# EAGLE design SMD Practice Board rev2 (EAGLE 9.1.3)
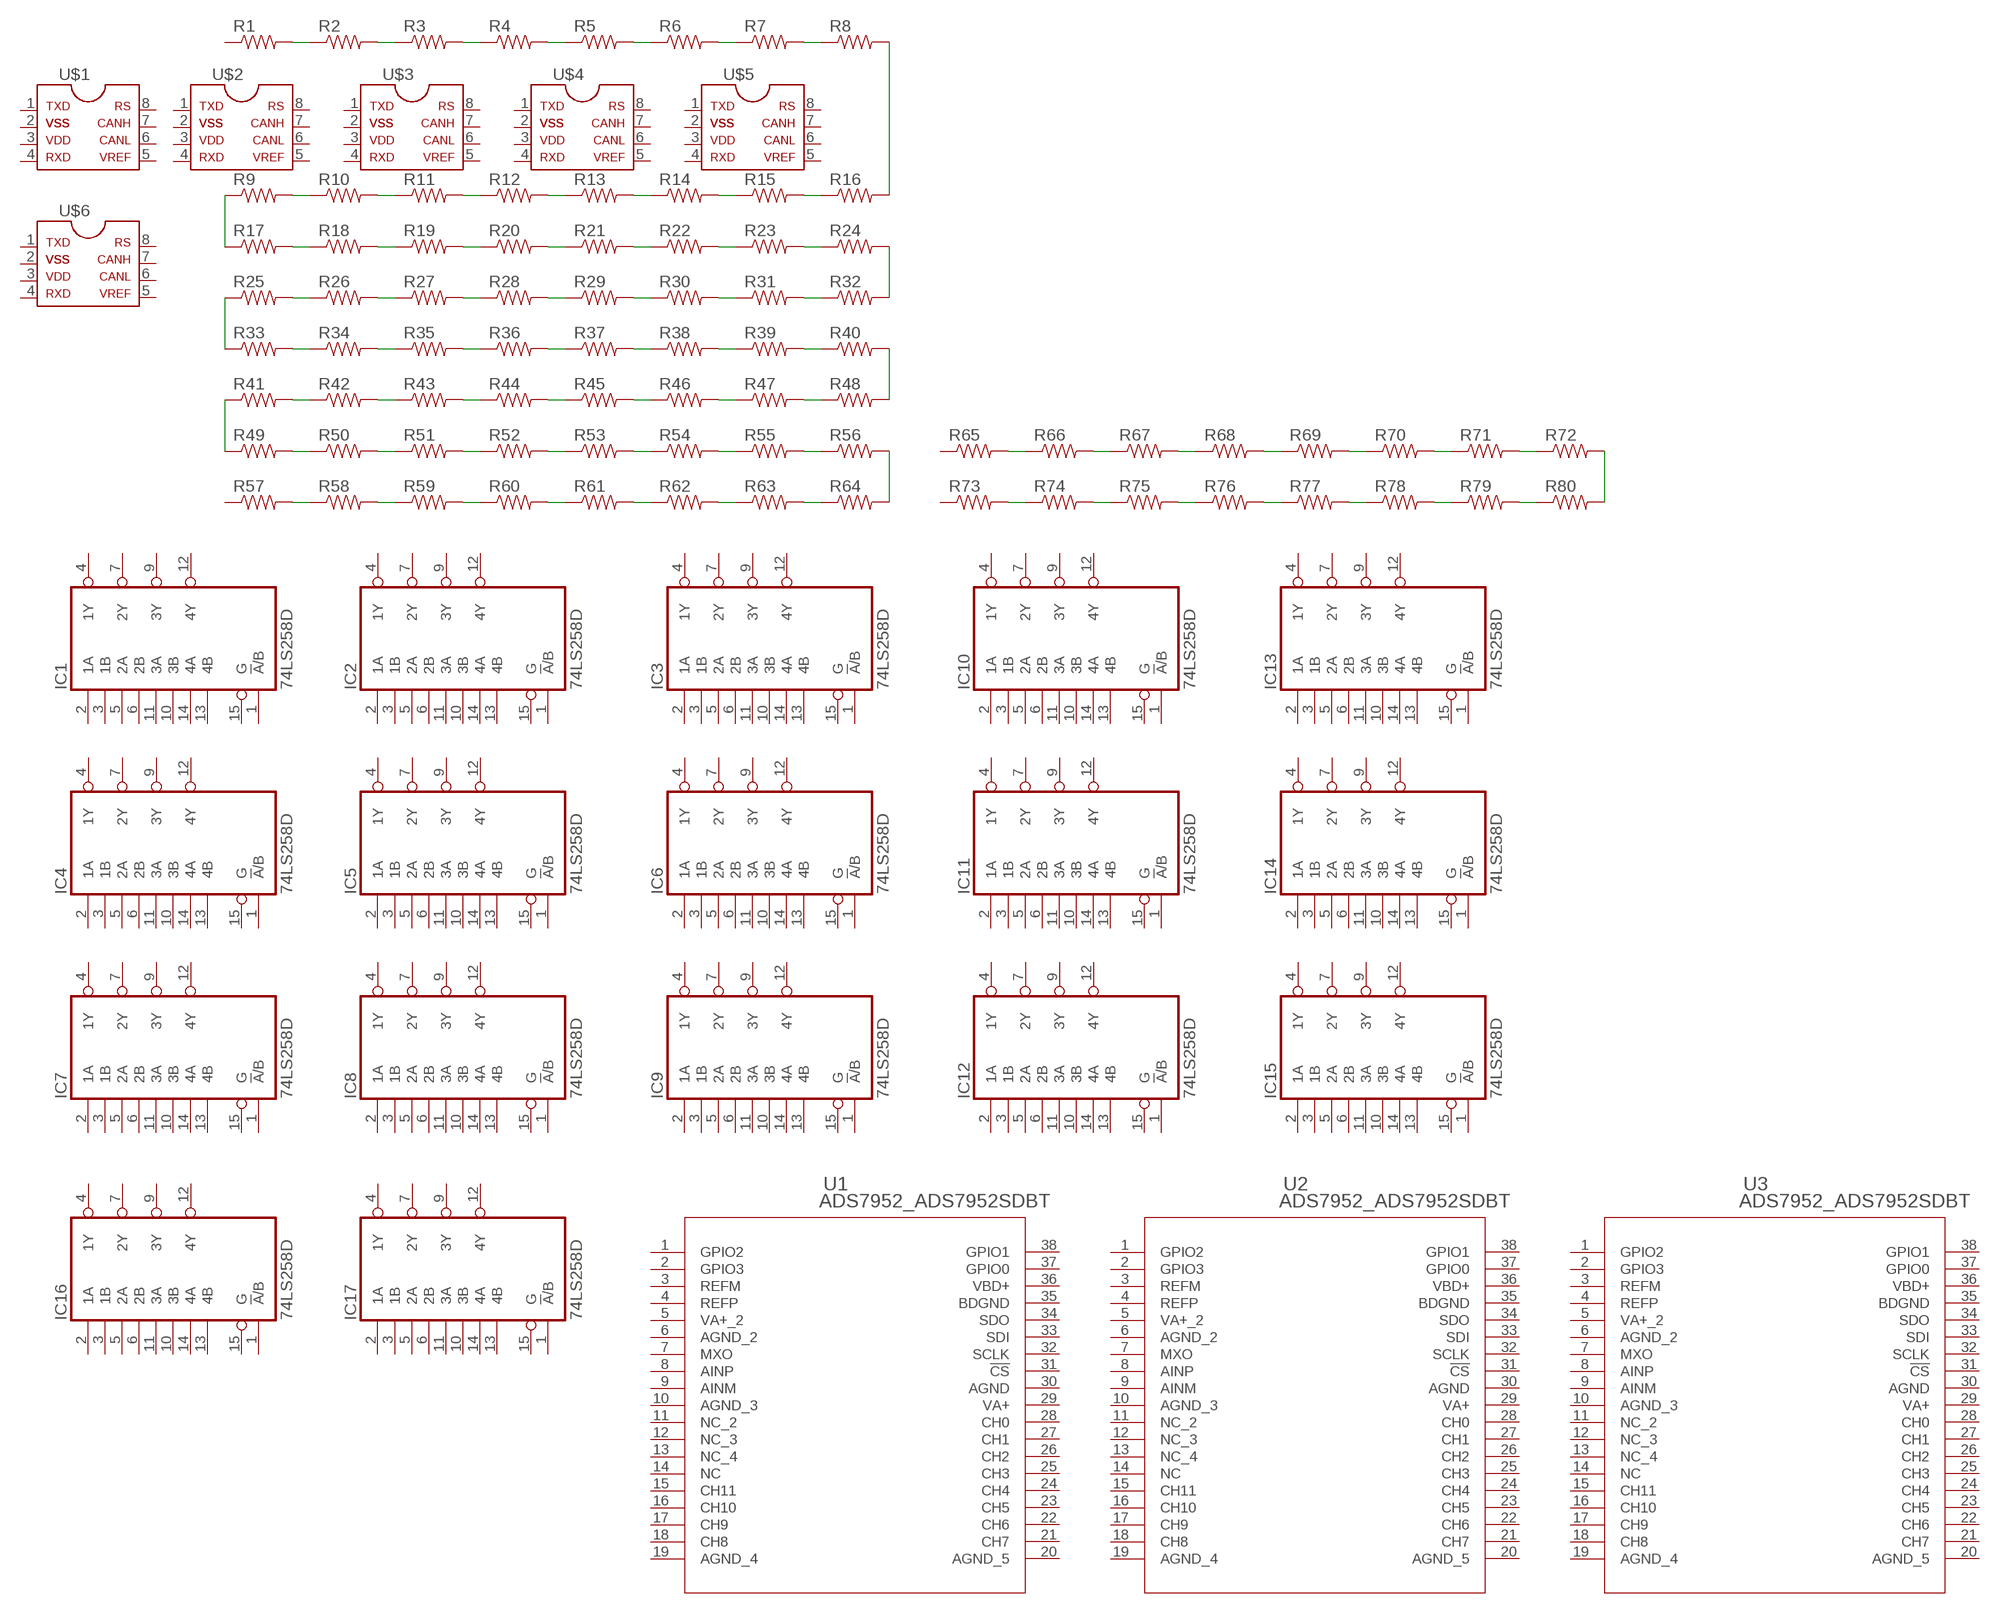
[diagram p0: schematic, sheet 1]

## Parts
IC1  74LS258D  [SO16]
IC2  74LS258D  [SO16]
IC3  74LS258D  [SO16]
IC4  74LS258D  [SO16]
IC5  74LS258D  [SO16]
IC6  74LS258D  [SO16]
IC7  74LS258D  [SO16]
IC8  74LS258D  [SO16]
IC9  74LS258D  [SO16]
IC10  74LS258D  [SO16]
IC11  74LS258D  [SO16]
IC12  74LS258D  [SO16]
IC13  74LS258D  [SO16]
IC14  74LS258D  [SO16]
IC15  74LS258D  [SO16]
IC16  74LS258D  [SO16]
IC17  74LS258D  [SO16]
R1  RESISTOR0805-RES  [0805]
R2  RESISTOR0805-RES  [0805]
R3  RESISTOR0805-RES  [0805]
R4  RESISTOR0805-RES  [0805]
R5  RESISTOR0805-RES  [0805]
R6  RESISTOR0805-RES  [0805]
R7  RESISTOR0805-RES  [0805]
R8  RESISTOR0805-RES  [0805]
R9  RESISTOR0805-RES  [0805]
R10  RESISTOR0805-RES  [0805]
R11  RESISTOR0805-RES  [0805]
R12  RESISTOR0805-RES  [0805]
R13  RESISTOR0805-RES  [0805]
R14  RESISTOR0805-RES  [0805]
R15  RESISTOR0805-RES  [0805]
R16  RESISTOR0805-RES  [0805]
R17  RESISTOR0805-RES  [0805]
R18  RESISTOR0805-RES  [0805]
R19  RESISTOR0805-RES  [0805]
R20  RESISTOR0805-RES  [0805]
R21  RESISTOR0805-RES  [0805]
R22  RESISTOR0805-RES  [0805]
R23  RESISTOR0805-RES  [0805]
R24  RESISTOR0805-RES  [0805]
R25  RESISTOR0805-RES  [0805]
R26  RESISTOR0805-RES  [0805]
R27  RESISTOR0805-RES  [0805]
R28  RESISTOR0805-RES  [0805]
R29  RESISTOR0805-RES  [0805]
R30  RESISTOR0805-RES  [0805]
R31  RESISTOR0805-RES  [0805]
R32  RESISTOR0805-RES  [0805]
R33  RESISTOR0805-RES  [0805]
R34  RESISTOR0805-RES  [0805]
R35  RESISTOR0805-RES  [0805]
R36  RESISTOR0805-RES  [0805]
R37  RESISTOR0805-RES  [0805]
R38  RESISTOR0805-RES  [0805]
R39  RESISTOR0805-RES  [0805]
R40  RESISTOR0805-RES  [0805]
R41  RESISTOR0805-RES  [0805]
R42  RESISTOR0805-RES  [0805]
R43  RESISTOR0805-RES  [0805]
R44  RESISTOR0805-RES  [0805]
R45  RESISTOR0805-RES  [0805]
R46  RESISTOR0805-RES  [0805]
R47  RESISTOR0805-RES  [0805]
R48  RESISTOR0805-RES  [0805]
R49  RESISTOR0805-RES  [0805]
R50  RESISTOR0805-RES  [0805]
R51  RESISTOR0805-RES  [0805]
R52  RESISTOR0805-RES  [0805]
R53  RESISTOR0805-RES  [0805]
R54  RESISTOR0805-RES  [0805]
R55  RESISTOR0805-RES  [0805]
R56  RESISTOR0805-RES  [0805]
R57  RESISTOR0805-RES  [0805]
R58  RESISTOR0805-RES  [0805]
R59  RESISTOR0805-RES  [0805]
R60  RESISTOR0805-RES  [0805]
R61  RESISTOR0805-RES  [0805]
R62  RESISTOR0805-RES  [0805]
R63  RESISTOR0805-RES  [0805]
R64  RESISTOR0805-RES  [0805]
R65  RESISTOR0805-RES  [0805]
R66  RESISTOR0805-RES  [0805]
R67  RESISTOR0805-RES  [0805]
R68  RESISTOR0805-RES  [0805]
R69  RESISTOR0805-RES  [0805]
R70  RESISTOR0805-RES  [0805]
R71  RESISTOR0805-RES  [0805]
R72  RESISTOR0805-RES  [0805]
R73  RESISTOR0805-RES  [0805]
R74  RESISTOR0805-RES  [0805]
R75  RESISTOR0805-RES  [0805]
R76  RESISTOR0805-RES  [0805]
R77  RESISTOR0805-RES  [0805]
R78  RESISTOR0805-RES  [0805]
R79  RESISTOR0805-RES  [0805]
R80  RESISTOR0805-RES  [0805]
U1  ADS7952_ADS7952SDBT  [ADS7952_DBT38]
U2  ADS7952_ADS7952SDBT  [ADS7952_DBT38]
U3  ADS7952_ADS7952SDBT  [ADS7952_DBT38]
U$1  MCP2551  [SOIC-08]
U$2  MCP2551  [SOIC-08]
U$3  MCP2551  [SOIC-08]
U$4  MCP2551  [SOIC-08]
U$5  MCP2551  [SOIC-08]
U$6  MCP2551  [SOIC-08]

## Nets
N$1: R1.2 R2.1
N$2: R2.2 R3.1
N$3: R3.2 R4.1
N$4: R5.2 R6.1
N$5: R6.2 R7.1
N$6: R7.2 R8.1
N$7: R4.2 R5.1
N$8: R9.2 R10.1
N$9: R10.2 R11.1
N$10: R11.2 R12.1
N$11: R13.2 R14.1
N$12: R14.2 R15.1
N$13: R15.2 R16.1
N$14: R12.2 R13.1
N$15: R8.2 R16.2
N$16: R17.2 R18.1
N$17: R18.2 R19.1
N$18: R19.2 R20.1
N$19: R21.2 R22.1
N$20: R22.2 R23.1
N$21: R23.2 R24.1
N$22: R20.2 R21.1
N$23: R25.2 R26.1
N$24: R26.2 R27.1
N$25: R27.2 R28.1
N$26: R29.2 R30.1
N$27: R30.2 R31.1
N$28: R31.2 R32.1
N$29: R28.2 R29.1
N$30: R24.2 R32.2
N$31: R9.1 R17.1
N$32: R33.2 R34.1
N$33: R34.2 R35.1
N$34: R35.2 R36.1
N$35: R37.2 R38.1
N$36: R38.2 R39.1
N$37: R39.2 R40.1
N$38: R36.2 R37.1
N$39: R41.2 R42.1
N$40: R42.2 R43.1
N$41: R43.2 R44.1
N$42: R45.2 R46.1
N$43: R46.2 R47.1
N$44: R47.2 R48.1
N$45: R44.2 R45.1
N$46: R40.2 R48.2
N$47: R49.2 R50.1
N$48: R50.2 R51.1
N$49: R51.2 R52.1
N$50: R53.2 R54.1
N$51: R54.2 R55.1
N$52: R55.2 R56.1
N$53: R52.2 R53.1
N$54: R57.2 R58.1
N$55: R58.2 R59.1
N$56: R59.2 R60.1
N$57: R61.2 R62.1
N$58: R62.2 R63.1
N$59: R63.2 R64.1
N$60: R60.2 R61.1
N$61: R56.2 R64.2
N$62: R41.1 R49.1
N$63: R25.1 R33.1
N$64: R65.2 R66.1
N$65: R66.2 R67.1
N$66: R67.2 R68.1
N$67: R69.2 R70.1
N$68: R70.2 R71.1
N$69: R71.2 R72.1
N$70: R68.2 R69.1
N$71: R73.2 R74.1
N$72: R74.2 R75.1
N$73: R75.2 R76.1
N$74: R77.2 R78.1
N$75: R78.2 R79.1
N$76: R79.2 R80.1
N$77: R76.2 R77.1
N$78: R72.2 R80.2
Unconnected: IC1.1(!A!/B) IC1.2(1A) IC1.3(1B) IC1.4(1Y) IC1.5(2A) IC1.6(2B) IC1.7(2Y) IC1.9(3Y) IC1.10(3B) IC1.11(3A) IC1.12(4Y) IC1.13(4B) IC1.14(4A) IC1.15(G) IC2.1(!A!/B) IC2.2(1A) IC2.3(1B) IC2.4(1Y) IC2.5(2A) IC2.6(2B) IC2.7(2Y) IC2.9(3Y) IC2.10(3B) IC2.11(3A) IC2.12(4Y) IC2.13(4B) IC2.14(4A) IC2.15(G) IC3.1(!A!/B) IC3.2(1A) IC3.3(1B) IC3.4(1Y) IC3.5(2A) IC3.6(2B) IC3.7(2Y) IC3.9(3Y) IC3.10(3B) IC3.11(3A) IC3.12(4Y) IC3.13(4B) IC3.14(4A) IC3.15(G) IC4.1(!A!/B) IC4.2(1A) IC4.3(1B) IC4.4(1Y) IC4.5(2A) IC4.6(2B) IC4.7(2Y) IC4.9(3Y) IC4.10(3B) IC4.11(3A) IC4.12(4Y) IC4.13(4B) IC4.14(4A) IC4.15(G) IC5.1(!A!/B) IC5.2(1A) IC5.3(1B) IC5.4(1Y) IC5.5(2A) IC5.6(2B) IC5.7(2Y) IC5.9(3Y) IC5.10(3B) IC5.11(3A) IC5.12(4Y) IC5.13(4B) IC5.14(4A) IC5.15(G) IC6.1(!A!/B) IC6.2(1A) IC6.3(1B) IC6.4(1Y) IC6.5(2A) IC6.6(2B) IC6.7(2Y) IC6.9(3Y) IC6.10(3B) IC6.11(3A) IC6.12(4Y) IC6.13(4B) IC6.14(4A) IC6.15(G) IC7.1(!A!/B) IC7.2(1A) IC7.3(1B) IC7.4(1Y) IC7.5(2A) IC7.6(2B) IC7.7(2Y) IC7.9(3Y) IC7.10(3B) IC7.11(3A) IC7.12(4Y) IC7.13(4B) IC7.14(4A) IC7.15(G) IC8.1(!A!/B) IC8.2(1A) IC8.3(1B) IC8.4(1Y) IC8.5(2A) IC8.6(2B) IC8.7(2Y) IC8.9(3Y) IC8.10(3B) IC8.11(3A) IC8.12(4Y) IC8.13(4B) IC8.14(4A) IC8.15(G) IC9.1(!A!/B) IC9.2(1A) IC9.3(1B) IC9.4(1Y) IC9.5(2A) IC9.6(2B) IC9.7(2Y) IC9.9(3Y) IC9.10(3B) IC9.11(3A) IC9.12(4Y) IC9.13(4B) IC9.14(4A) IC9.15(G) IC10.1(!A!/B) IC10.2(1A) IC10.3(1B) IC10.4(1Y) IC10.5(2A) IC10.6(2B) IC10.7(2Y) IC10.9(3Y) IC10.10(3B) IC10.11(3A) IC10.12(4Y) IC10.13(4B) IC10.14(4A) IC10.15(G) IC11.1(!A!/B) IC11.2(1A) IC11.3(1B) IC11.4(1Y) IC11.5(2A) IC11.6(2B) IC11.7(2Y) IC11.9(3Y) IC11.10(3B) IC11.11(3A) IC11.12(4Y) IC11.13(4B) IC11.14(4A) IC11.15(G) IC12.1(!A!/B) IC12.2(1A) IC12.3(1B) IC12.4(1Y) IC12.5(2A) IC12.6(2B) IC12.7(2Y) IC12.9(3Y) IC12.10(3B) IC12.11(3A) IC12.12(4Y) IC12.13(4B) IC12.14(4A) IC12.15(G) IC13.1(!A!/B) IC13.2(1A) IC13.3(1B) IC13.4(1Y) IC13.5(2A) IC13.6(2B) IC13.7(2Y) IC13.9(3Y) IC13.10(3B) IC13.11(3A) IC13.12(4Y) IC13.13(4B) IC13.14(4A) IC13.15(G) IC14.1(!A!/B) IC14.2(1A) IC14.3(1B) IC14.4(1Y) IC14.5(2A) IC14.6(2B) IC14.7(2Y) IC14.9(3Y) IC14.10(3B) IC14.11(3A) IC14.12(4Y) IC14.13(4B) IC14.14(4A) IC14.15(G) IC15.1(!A!/B) IC15.2(1A) IC15.3(1B) IC15.4(1Y) IC15.5(2A) IC15.6(2B) IC15.7(2Y) IC15.9(3Y) IC15.10(3B) IC15.11(3A) IC15.12(4Y) IC15.13(4B) IC15.14(4A) IC15.15(G) IC16.1(!A!/B) IC16.2(1A) IC16.3(1B) IC16.4(1Y) IC16.5(2A) IC16.6(2B) IC16.7(2Y) IC16.9(3Y) IC16.10(3B) IC16.11(3A) IC16.12(4Y) IC16.13(4B) IC16.14(4A) IC16.15(G) IC17.1(!A!/B) IC17.2(1A) IC17.3(1B) IC17.4(1Y) IC17.5(2A) IC17.6(2B) IC17.7(2Y) IC17.9(3Y) IC17.10(3B) IC17.11(3A) IC17.12(4Y) IC17.13(4B) IC17.14(4A) IC17.15(G) R1.1 R57.1 R65.1 R73.1 U1.1(GPIO2) U1.2(GPIO3) U1.3(REFM) U1.4(REFP) U1.7(MXO) U1.8(AINP) U1.9(AINM) U1.11(NC_2) U1.12(NC_3) U1.13(NC_4) U1.14(NC) U1.15(CH11) U1.16(CH10) U1.17(CH9) U1.18(CH8) U1.21(CH7) U1.22(CH6) U1.23(CH5) U1.24(CH4) U1.25(CH3) U1.26(CH2) U1.27(CH1) U1.28(CH0) U1.31(!CS) U1.32(SCLK) U1.33(SDI) U1.34(SDO) U1.37(GPIO0) U1.38(GPIO1) U2.1(GPIO2) U2.2(GPIO3) U2.3(REFM) U2.4(REFP) U2.7(MXO) U2.8(AINP) U2.9(AINM) U2.11(NC_2) U2.12(NC_3) U2.13(NC_4) U2.14(NC) U2.15(CH11) U2.16(CH10) U2.17(CH9) U2.18(CH8) U2.21(CH7) U2.22(CH6) U2.23(CH5) U2.24(CH4) U2.25(CH3) U2.26(CH2) U2.27(CH1) U2.28(CH0) U2.31(!CS) U2.32(SCLK) U2.33(SDI) U2.34(SDO) U2.37(GPIO0) U2.38(GPIO1) U3.1(GPIO2) U3.2(GPIO3) U3.3(REFM) U3.4(REFP) U3.7(MXO) U3.8(AINP) U3.9(AINM) U3.11(NC_2) U3.12(NC_3) U3.13(NC_4) U3.14(NC) U3.15(CH11) U3.16(CH10) U3.17(CH9) U3.18(CH8) U3.21(CH7) U3.22(CH6) U3.23(CH5) U3.24(CH4) U3.25(CH3) U3.26(CH2) U3.27(CH1) U3.28(CH0) U3.31(!CS) U3.32(SCLK) U3.33(SDI) U3.34(SDO) U3.37(GPIO0) U3.38(GPIO1) U$1.1 U$1.2 U$1.3 U$1.4 U$1.5 U$1.6 U$1.7 U$1.8 U$2.1 U$2.2 U$2.3 U$2.4 U$2.5 U$2.6 U$2.7 U$2.8 U$3.1 U$3.2 U$3.3 U$3.4 U$3.5 U$3.6 U$3.7 U$3.8 U$4.1 U$4.2 U$4.3 U$4.4 U$4.5 U$4.6 U$4.7 U$4.8 U$5.1 U$5.2 U$5.3 U$5.4 U$5.5 U$5.6 U$5.7 U$5.8 U$6.1 U$6.2 U$6.3 U$6.4 U$6.5 U$6.6 U$6.7 U$6.8

## Power pins joined to a net without a drawn wire
AGND: U1.30(AGND) U2.30(AGND) U3.30(AGND)
AGND_2: U1.6(AGND_2) U2.6(AGND_2) U3.6(AGND_2)
AGND_3: U1.10(AGND_3) U2.10(AGND_3) U3.10(AGND_3)
AGND_4: U1.19(AGND_4) U2.19(AGND_4) U3.19(AGND_4)
AGND_5: U1.20(AGND_5) U2.20(AGND_5) U3.20(AGND_5)
BDGND: U1.35(BDGND) U2.35(BDGND) U3.35(BDGND)
GND: IC1.8(GND) IC2.8(GND) IC3.8(GND) IC4.8(GND) IC5.8(GND) IC6.8(GND) IC7.8(GND) IC8.8(GND) IC9.8(GND) IC10.8(GND) IC11.8(GND) IC12.8(GND) IC13.8(GND) IC14.8(GND) IC15.8(GND) IC16.8(GND) IC17.8(GND)
VA+: U1.29(VA+) U2.29(VA+) U3.29(VA+)
VA+_2: U1.5(VA+_2) U2.5(VA+_2) U3.5(VA+_2)
VBD+: U1.36(VBD+) U2.36(VBD+) U3.36(VBD+)
VCC: IC1.16(VCC) IC2.16(VCC) IC3.16(VCC) IC4.16(VCC) IC5.16(VCC) IC6.16(VCC) IC7.16(VCC) IC8.16(VCC) IC9.16(VCC) IC10.16(VCC) IC11.16(VCC) IC12.16(VCC) IC13.16(VCC) IC14.16(VCC) IC15.16(VCC) IC16.16(VCC) IC17.16(VCC)

## Library data of the parts
IC1-IC17 = 74xx-us:74*258: Quadruple 2-to 1 line data SELECTOR/MULTIPLEXER
R1-R80 = HyTechDevices:RESISTOR: Resistor Basic schematic elements and footprints for 0603, 1206, and PTH resistors.
U1-U3 = TSSOP38 Breakout Board:ADS7952_ADS7952SDBT; MANUFACTURER_PART_NUMBER: ADS7952SDBT; VENDOR: Texas Instruments
U$1-U$6 = HyTechDevices:MCP2551: MCP2551 High-Speed CAN Transceiver Product Webpage <https://www.microchip.com/wwwproducts/en/MCP2551> Datasheet <http://ww1.microchip.com/downloads/en/DeviceDoc/21667f.pdf> This device is outdated It is replaced by MCP2561. Comparison Page <https://www.microchip.com/wwwproducts/ProductCompare/MCP2551/MCP2561> Product Webpage <https://www.microchip.com/wwwproducts/en/MCP2561> Datasheet <http://ww1.microchip.com/downloads/en/DeviceDoc/20005167C.pdf>

## Board
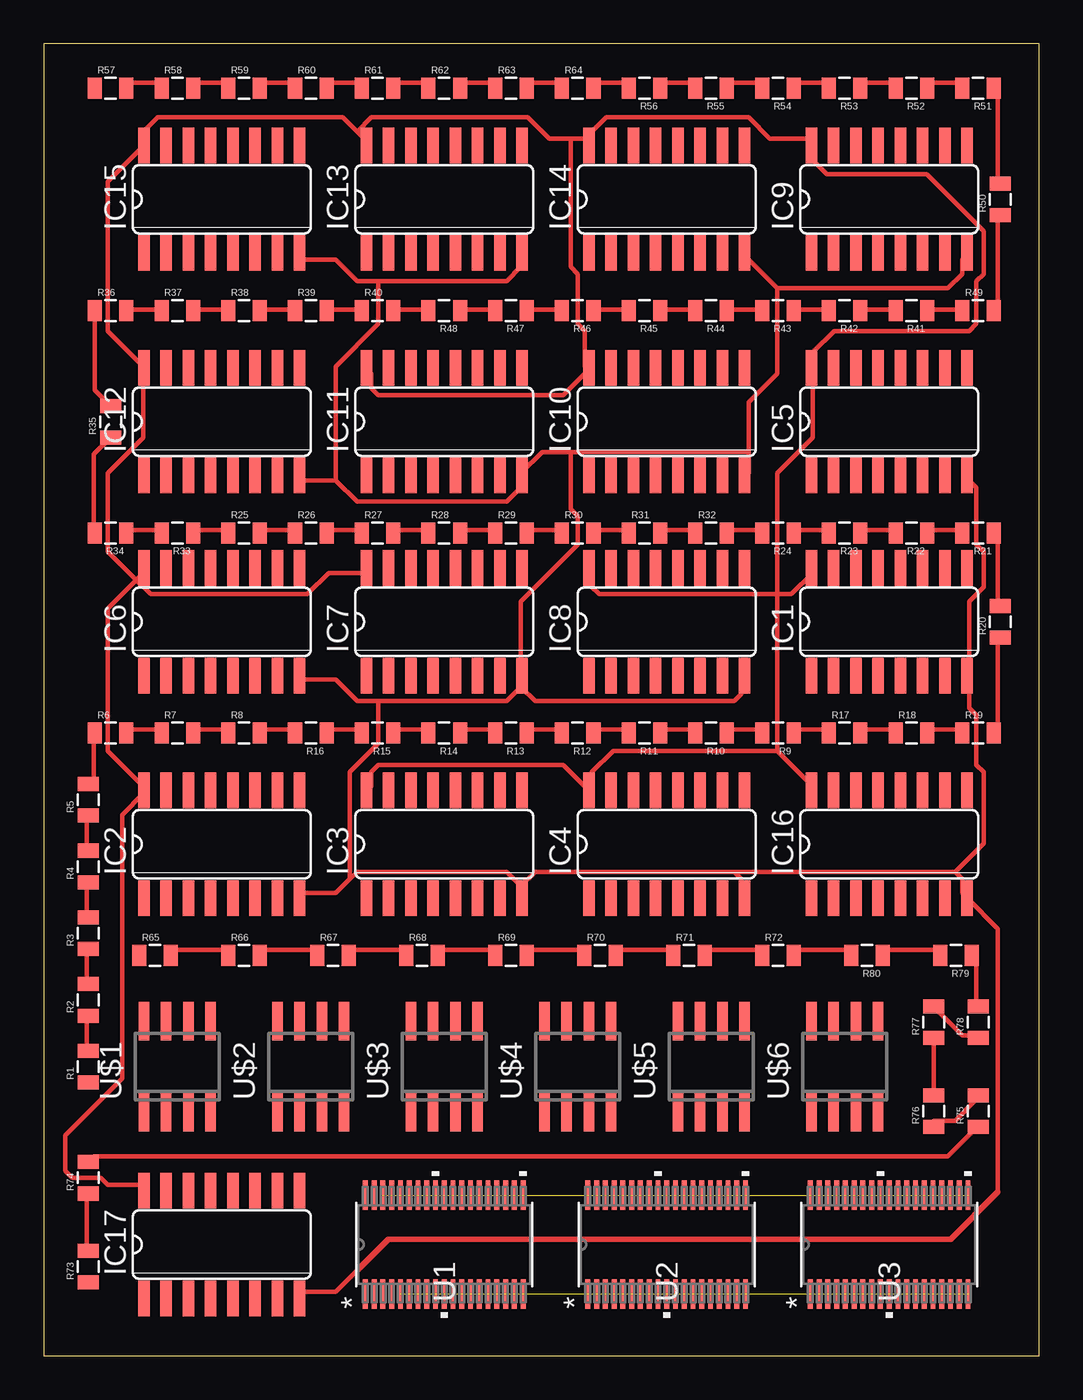
[diagram p1: board, top side]

Size 56.82 x 74.92 mm. Coordinates in mm from the lower left corner, seen from the top.
Outline: 0,0 56.82,0 56.82,74.92 0,74.92 0,0
Copper layers (1*16): Top 0.035mm / dielectric 1.5mm / Bottom 0.035mm
Design rules "default": minimum track width 10mil, minimum drill 24mil, track to track 8mil, track to pad 8mil, pad to pad 8mil, via to via 8mil, smd to smd 8mil, copper to edge 40mil, drill to drill 8mil, minimum pad ring 10mil, minimum via ring 8mil, stop-mask expansion 4mil, vias tented up to drill 0mil, thermal gap 10mil

### Footprints (pad centres in the part's own frame; a part is rotated, then mirrored left to right if it is on the bottom)
SO16 = smd 0.66 x 2.032: 1 -4.445,-3.073; 2 -3.175,-3.073; 3 -1.905,-3.073; 4 -0.635,-3.073; 5 0.635,-3.073; 6 1.905,-3.073; 7 3.175,-3.073; 8 4.445,-3.073; 9 4.445,3.073; 10 3.175,3.073; 11 1.905,3.073; 12 0.635,3.073; 13 -0.635,3.073; 14 -1.905,3.073; 15 -3.175,3.073; 16 -4.445,3.073
0805 = smd 0.8 x 1.2: 1 -0.9,0; 2 0.9,0
ADS7952_DBT38 = smd 1.676 x 0.279: 1 -2.819,4.5; 2 -2.819,4; 3 -2.819,3.5; 4 -2.819,3; 5 -2.819,2.5; 6 -2.819,2; 7 -2.819,1.5; 8 -2.819,1; 9 -2.819,0.5; 10 -2.819,0; 11 -2.819,-0.5; 12 -2.819,-1; 13 -2.819,-1.5; 14 -2.819,-2; 15 -2.819,-2.5; 16 -2.819,-3; 17 -2.819,-3.5; 18 -2.819,-4; 19 -2.819,-4.5; 20 2.819,-4.5; 21 2.819,-4; 22 2.819,-3.5; 23 2.819,-3; 24 2.819,-2.5; 25 2.819,-2; 26 2.819,-1.5; 27 2.819,-1; 28 2.819,-0.5; 29 2.819,0; 30 2.819,0.5; 31 2.819,1; 32 2.819,1.5; 33 2.819,2; 34 2.819,2.5; 35 2.819,3; 36 2.819,3.5; 37 2.819,4; 38 2.819,4.5
SOIC-08 = smd 0.6 x 2.2: 1 -1.905,-2.6; 2 -0.635,-2.6; 3 0.635,-2.6; 4 1.905,-2.6; 5 1.905,2.6; 6 0.635,2.6; 7 -0.635,2.6; 8 -1.905,2.6

### Placement (x,y rotation side)
IC1  48.26,41.91 0 top
IC2  10.16,29.21 0 top
IC3  22.86,29.21 0 top
IC4  35.56,29.21 0 top
IC5  48.26,53.34 0 top
IC6  10.16,41.91 0 top
IC7  22.86,41.91 0 top
IC8  35.56,41.91 0 top
IC9  48.26,66.04 0 top
IC10  35.56,53.34 0 top
IC11  22.86,53.34 0 top
IC12  10.16,53.34 0 top
IC13  22.86,66.04 0 top
IC14  35.56,66.04 0 top
IC15  10.16,66.04 0 top
IC16  48.26,29.21 0 top
IC17  10.16,6.35 0 top
R1  2.54,16.51 90 top
R2  2.54,20.32 90 top
R3  2.54,24.13 90 top
R4  2.54,27.94 90 top
R5  2.54,31.75 90 top
R6  3.81,35.56 0 top
R7  7.62,35.56 0 top
R8  11.43,35.56 0 top
R9  41.91,35.56 180 top
R10  38.1,35.56 180 top
R11  34.29,35.56 180 top
R12  30.48,35.56 180 top
R13  26.67,35.56 180 top
R14  22.86,35.56 180 top
R15  19.05,35.56 180 top
R16  15.24,35.56 180 top
R17  45.72,35.56 0 top
R18  49.53,35.56 0 top
R19  53.34,35.56 0 top
R20  54.61,41.91 90 top
R21  53.34,46.99 180 top
R22  49.53,46.99 180 top
R23  45.72,46.99 180 top
R24  41.91,46.99 180 top
R25  11.43,46.99 0 top
R26  15.24,46.99 0 top
R27  19.05,46.99 0 top
R28  22.86,46.99 0 top
R29  26.67,46.99 0 top
R30  30.48,46.99 0 top
R31  34.29,46.99 0 top
R32  38.1,46.99 0 top
R33  7.62,46.99 180 top
R34  3.81,46.99 180 top
R35  3.81,53.34 90 top
R36  3.81,59.69 0 top
R37  7.62,59.69 0 top
R38  11.43,59.69 0 top
R39  15.24,59.69 0 top
R40  19.05,59.69 0 top
R41  49.53,59.69 180 top
R42  45.72,59.69 180 top
R43  41.91,59.69 180 top
R44  38.1,59.69 180 top
R45  34.29,59.69 180 top
R46  30.48,59.69 180 top
R47  26.67,59.69 180 top
R48  22.86,59.69 180 top
R49  53.34,59.69 0 top
R50  54.61,66.04 90 top
R51  53.34,72.39 180 top
R52  49.53,72.39 180 top
R53  45.72,72.39 180 top
R54  41.91,72.39 180 top
R55  38.1,72.39 180 top
R56  34.29,72.39 180 top
R57  3.81,72.39 0 top
R58  7.62,72.39 0 top
R59  11.43,72.39 0 top
R60  15.24,72.39 0 top
R61  19.05,72.39 0 top
R62  22.86,72.39 0 top
R63  26.67,72.39 0 top
R64  30.48,72.39 0 top
R65  6.35,22.86 0 top
R66  11.43,22.86 0 top
R67  16.51,22.86 0 top
R68  21.59,22.86 0 top
R69  26.67,22.86 0 top
R70  31.75,22.86 0 top
R71  36.83,22.86 0 top
R72  41.91,22.86 0 top
R73  2.54,5.08 90 top
R74  2.54,10.16 90 top
R75  53.34,13.97 90 top
R76  50.8,13.97 90 top
R77  50.8,19.05 90 top
R78  53.34,19.05 90 top
R79  52.07,22.86 180 top
R80  46.99,22.86 180 top
U1  22.86,6.35 90 top
U2  35.56,6.35 90 top
U3  48.26,6.35 90 top
U$1  7.62,16.51 0 top
U$2  15.24,16.51 0 top
U$3  22.86,16.51 0 top
U$4  30.48,16.51 0 top
U$5  38.1,16.51 0 top
U$6  45.72,16.51 0 top

### Tracks (layer width: path | path; a pad name or v marks a point on that pad's centre or on a via)
AGND  (2 unrouted)
AGND_2  (2 unrouted)
AGND_3  (2 unrouted)
AGND_4  (2 unrouted)
AGND_5  (2 unrouted)
BDGND  (2 unrouted)
GND
  Top 0.254: 40.23,51.61 40.23,54.46 41.86,56.08 41.86,60.96 | 40.23,51.61 40.23,50.39 IC10.8 | 41.86,60.96 40.23,62.59 IC14.8 | 41.86,60.96 51.61,60.96 52.43,61.77 52.43,62.59 IC9.8 | 16.66,49.99 14.63,49.99 IC12.8 | 16.66,49.99 17.88,48.77 26.42,48.77 27.23,49.58 27.23,49.99 IC11.8 27.23,50.39 28.45,51.61 30.07,51.61 | 19.1,61.37 26.42,61.37 27.23,62.18 27.23,62.59 IC13.8 | 19.1,61.37 17.88,61.37 16.66,62.59 14.63,62.59 IC15.8 | 16.66,49.99 16.66,56.49 19.1,58.93 19.1,61.37 | 30.07,51.61 40.23,51.61 | 17.88,4.88 16.66,3.66 14.63,3.66 IC17.8 | 19.1,37.39 26.42,37.39 27.23,38.2 | 19.1,37.39 17.88,37.39 16.66,38.61 14.63,38.61 IC6.8 | 27.23,38.2 27.23,38.61 IC7.8 | 27.23,38.2 28.04,37.39 39.42,37.39 39.83,37.8 39.83,38.61 IC8.8 | 27.23,38.2 IC7.8 | IC5.8 52.83,49.99 53.24,49.58 53.24,46.33 53.65,45.92 53.65,43.89 52.83,43.08 52.83,39.01 IC1.8 52.83,38.61 52.83,36.98 53.24,36.58 53.24,33.73 53.65,33.33 53.65,29.26 52.02,27.64 | 17.48,27.23 17.88,27.64 26.42,27.64 27.23,26.82 | 17.48,27.23 16.66,26.42 14.63,26.42 IC2.8 | 27.23,26.82 27.23,26.42 IC3.8 27.23,26.82 | 39.42,27.64 39.83,27.23 39.83,26.42 IC4.8 | 39.42,27.64 28.04,27.64 27.23,26.82 | 52.02,27.64 52.43,27.23 52.43,26.42 IC16.8 54.46,24.38 54.46,9.35 | 39.42,27.64 52.02,27.64 | 19.1,37.39 19.1,34.95 17.48,33.33 17.48,27.23 | 30.07,51.61 30.07,48.36 30.48,47.95 30.48,46.33 27.23,43.08 27.23,39.01 IC7.8
  Top 0.305: 54.46,9.35 51.77,6.66 19.66,6.66 17.88,4.88
N$1
  Top 0.254: R1.2 2.44,17.48 2.44,19.1 R2.1
N$2
  Top 0.254: R2.2 2.44,21.54 2.44,23.16 R3.1
N$3
  Top 0.254: R3.2 2.44,25.2 2.44,26.82 R4.1
N$4
  Top 0.254: R5.2 2.85,32.92 2.85,35.36 R6.1
N$5
  Top 0.254: R6.2 4.88,35.76 6.5,35.76 R7.1
N$6
  Top 0.254: R7.2 8.53,35.76 10.16,35.76 R8.1
N$7
  Top 0.254: R4.2 2.44,28.85 2.44,30.48 R5.1
N$8
  Top 0.254: R10.1 39.01,35.76 40.64,35.76 R9.2
N$9
  Top 0.254: R11.1 35.36,35.76 36.98,35.76 R10.2
N$10
  Top 0.254: R12.1 31.7,35.76 33.33,35.76 R11.2
N$11
  Top 0.254: R14.1 23.98,35.76 25.6,35.76 R13.2
N$12
  Top 0.254: R15.1 20.32,35.76 21.95,35.76 R14.2
N$13
  Top 0.254: R16.1 16.26,35.76 17.88,35.76 R15.2
N$14
  Top 0.254: R13.1 27.64,35.76 29.26,35.76 R12.2
N$15
  Top 0.254: R8.2 12.6,35.76 14.22,35.76 R16.2
N$16
  Top 0.254: R17.2 46.74,35.76 48.36,35.76 R18.1
N$17
  Top 0.254: R18.2 50.8,35.76 52.43,35.76 R19.1
N$18
  Top 0.254: R19.2 54.46,35.76 54.46,40.64 R20.1
N$19
  Top 0.254: R22.1 50.8,47.14 52.43,47.14 R21.2
N$20
  Top 0.254: R23.1 46.74,47.14 48.36,47.14 R22.2
N$21
  Top 0.254: R24.1 43.08,47.14 44.7,47.14 R23.2
N$22
  Top 0.254: R21.1 54.46,46.74 54.46,43.08 R20.2
N$23
  Top 0.254: R25.2 12.6,47.14 14.22,47.14 R26.1
N$24
  Top 0.254: R26.2 16.26,47.14 17.88,47.14 R27.1
N$25
  Top 0.254: R27.2 20.32,47.14 21.95,47.14 R28.1
N$26
  Top 0.254: R29.2 27.64,47.14 29.26,47.14 R30.1
N$27
  Top 0.254: R30.2 31.7,47.14 33.33,47.14 R31.1
N$28
  Top 0.254: R31.2 35.36,47.14 36.98,47.14 R32.1
N$29
  Top 0.254: R28.2 23.98,47.14 25.6,47.14 R29.1
N$30
  Top 0.254: R32.2 39.01,47.14 40.64,47.14 R24.2
N$31
  Top 0.254: R9.1 43.08,35.76 44.7,35.76 R17.1
N$32
  Top 0.254: R34.1 4.88,47.14 6.5,47.14 R33.2
N$33
  Top 0.254: R34.2 2.85,47.14 2.85,51.48 R35.1
N$34
  Top 0.254: R35.2 2.91,55.14 R36.1
N$35
  Top 0.254: R37.2 8.53,59.74 10.16,59.74 R38.1
N$36
  Top 0.254: R38.2 12.6,59.74 14.22,59.74 R39.1
N$37
  Top 0.254: R39.2 16.26,59.74 17.88,59.74 R40.1
N$38
  Top 0.254: R36.2 4.88,59.74 6.5,59.74 R37.1
N$39
  Top 0.254: R42.1 46.74,59.74 48.36,59.74 R41.2
N$40
  Top 0.254: R43.1 43.08,59.74 44.7,59.74 R42.2
N$41
  Top 0.254: R44.1 39.01,59.74 40.64,59.74 R43.2
N$42
  Top 0.254: R46.1 31.7,59.74 33.33,59.74 R45.2
N$43
  Top 0.254: R47.1 27.64,59.74 29.26,59.74 R46.2
N$44
  Top 0.254: R48.1 23.98,59.74 25.6,59.74 R47.2
N$45
  Top 0.254: R45.1 35.36,59.74 36.98,59.74 R44.2
N$46
  Top 0.254: R40.2 20.32,59.74 21.95,59.74 R48.2
N$47
  Top 0.254: R49.2 54.46,59.74 54.46,65.02 R50.1
N$48
  Top 0.254: R51.1 54.46,72.29 54.46,67.06 R50.2
N$49
  Top 0.254: R52.1 50.8,72.69 52.43,72.69 R51.2
N$50
  Top 0.254: R54.1 43.08,72.69 44.7,72.69 R53.2
N$51
  Top 0.254: R55.1 39.01,72.69 40.64,72.69 R54.2
N$52
  Top 0.254: R56.1 35.36,72.69 36.98,72.69 R55.2
N$53
  Top 0.254: R53.1 46.74,72.69 48.36,72.69 R52.2
N$54
  Top 0.254: R57.2 4.88,72.69 6.5,72.69 R58.1
N$55
  Top 0.254: R58.2 8.53,72.69 10.16,72.69 R59.1
N$56
  Top 0.254: R59.2 12.6,72.69 14.22,72.69 R60.1
N$57
  Top 0.254: R61.2 20.32,72.69 21.95,72.69 R62.1
N$58
  Top 0.254: R62.2 23.98,72.69 25.6,72.69 R63.1
N$59
  Top 0.254: R63.2 27.64,72.69 29.26,72.69 R64.1
N$60
  Top 0.254: R60.2 16.26,72.69 17.88,72.69 R61.1
N$61
  Top 0.254: R64.2 31.7,72.69 33.33,72.69 R56.2
N$62
  Top 0.254: R41.1 50.8,59.74 52.43,59.74 R49.1
N$63
  Top 0.254: R33.1 8.53,47.14 10.16,47.14 R25.1
N$64
  Top 0.254: R65.2 7.32,23.16 10.16,23.16 R66.1
N$65
  Top 0.254: R66.2 12.6,23.16 15.44,23.16 R67.1
N$66
  Top 0.254: R67.2 17.48,23.16 20.32,23.16 R68.1
N$67
  Top 0.254: R69.2 27.64,23.16 30.48,23.16 R70.1
N$68
  Top 0.254: R70.2 32.92,23.16 35.76,23.16 R71.1
N$69
  Top 0.254: R71.2 37.8,23.16 40.64,23.16 R72.1
N$70
  Top 0.254: R68.2 22.76,23.16 25.6,23.16 R69.1
N$71
  Top 0.254: R73.2 2.44,6.1 2.44,8.94 R74.1
N$72
  Top 0.254: R74.2 2.85,11.38 51.61,11.38 53.24,13.01 R75.1
N$73
  Top 0.254: R76.1 50.8,13.41 52.02,13.41 53.24,14.63 R75.2
N$74
  Top 0.254: R78.1 53.24,18.29 52.43,18.29 50.8,19.91 R77.2
N$75
  Top 0.254: R79.1 53.24,22.76 53.24,20.32 R78.2
N$76
  Top 0.254: R80.1 47.95,23.16 50.8,23.16 R79.2
N$77
  Top 0.254: R77.1 R76.2
N$78
  Top 0.254: R72.2 43.08,23.16 45.92,23.16 R80.2
VA+  (2 unrouted)
VA+_2  (2 unrouted)
VBD+  (2 unrouted)
VCC
  Top 0.254: IC3.16 18.69,32.51 18.69,33.33 19.1,33.73 29.67,33.73 IC4.16 31.29,32.51 31.29,33.33 32.51,34.54 41.86,34.54 | 41.86,43.48 42.67,43.48 43.89,44.7 IC1.16 | 41.86,43.48 31.7,43.48 31.29,43.89 31.29,44.7 IC8.16 | 41.86,34.54 43.89,32.51 IC16.16 | 41.86,43.48 41.86,34.54 | 41.86,43.48 41.86,50.39 43.89,52.43 43.89,56.08 IC5.16 43.89,56.49 43.89,57.3 45.11,58.52 52.83,58.52 53.24,58.93 53.24,61.37 53.65,61.77 53.65,64.21 50.39,67.46 44.7,67.46 43.89,68.28 43.89,69.09 IC9.16 43.89,69.49 41.45,69.49 40.23,70.71 32.11,70.71 30.89,69.49 | 5.69,8.53 5.69,9.35 IC17.16 5.69,9.75 3.66,9.75 3.25,10.16 1.63,10.16 1.22,10.57 1.22,12.6 4.47,15.85 4.47,30.89 5.69,32.11 IC2.16 5.69,32.51 3.66,34.54 3.66,42.67 5.28,44.3 | 5.28,44.3 5.69,44.7 IC6.16 | 5.28,44.3 3.66,45.92 3.66,50.39 5.69,52.43 5.69,56.08 IC12.16 5.69,56.49 3.66,58.52 3.66,67.06 IC15.16 5.69,69.49 5.69,69.9 6.5,70.71 17.07,70.71 17.88,69.9 | 5.28,44.3 6.1,43.48 15.04,43.48 16.26,44.7 18.29,44.7 IC7.16 | IC11.16 18.69,56.08 18.69,55.27 19.1,54.86 29.67,54.86 30.89,56.08 IC10.16 30.89,56.49 30.89,58.52 30.48,58.93 30.48,61.77 30.07,62.18 30.07,69.49 | 17.88,69.9 18.29,69.49 IC13.16 | 30.07,69.49 28.85,69.49 27.64,70.71 18.69,70.71 17.88,69.9 | 30.07,69.49 30.89,69.49 | 30.89,69.49 IC14.16

### Text on the board
tDocu: HyTech Racing 2019 SMD Practice Board rev2